# EAGLE design PT100RTD (EAGLE 6.5.0)
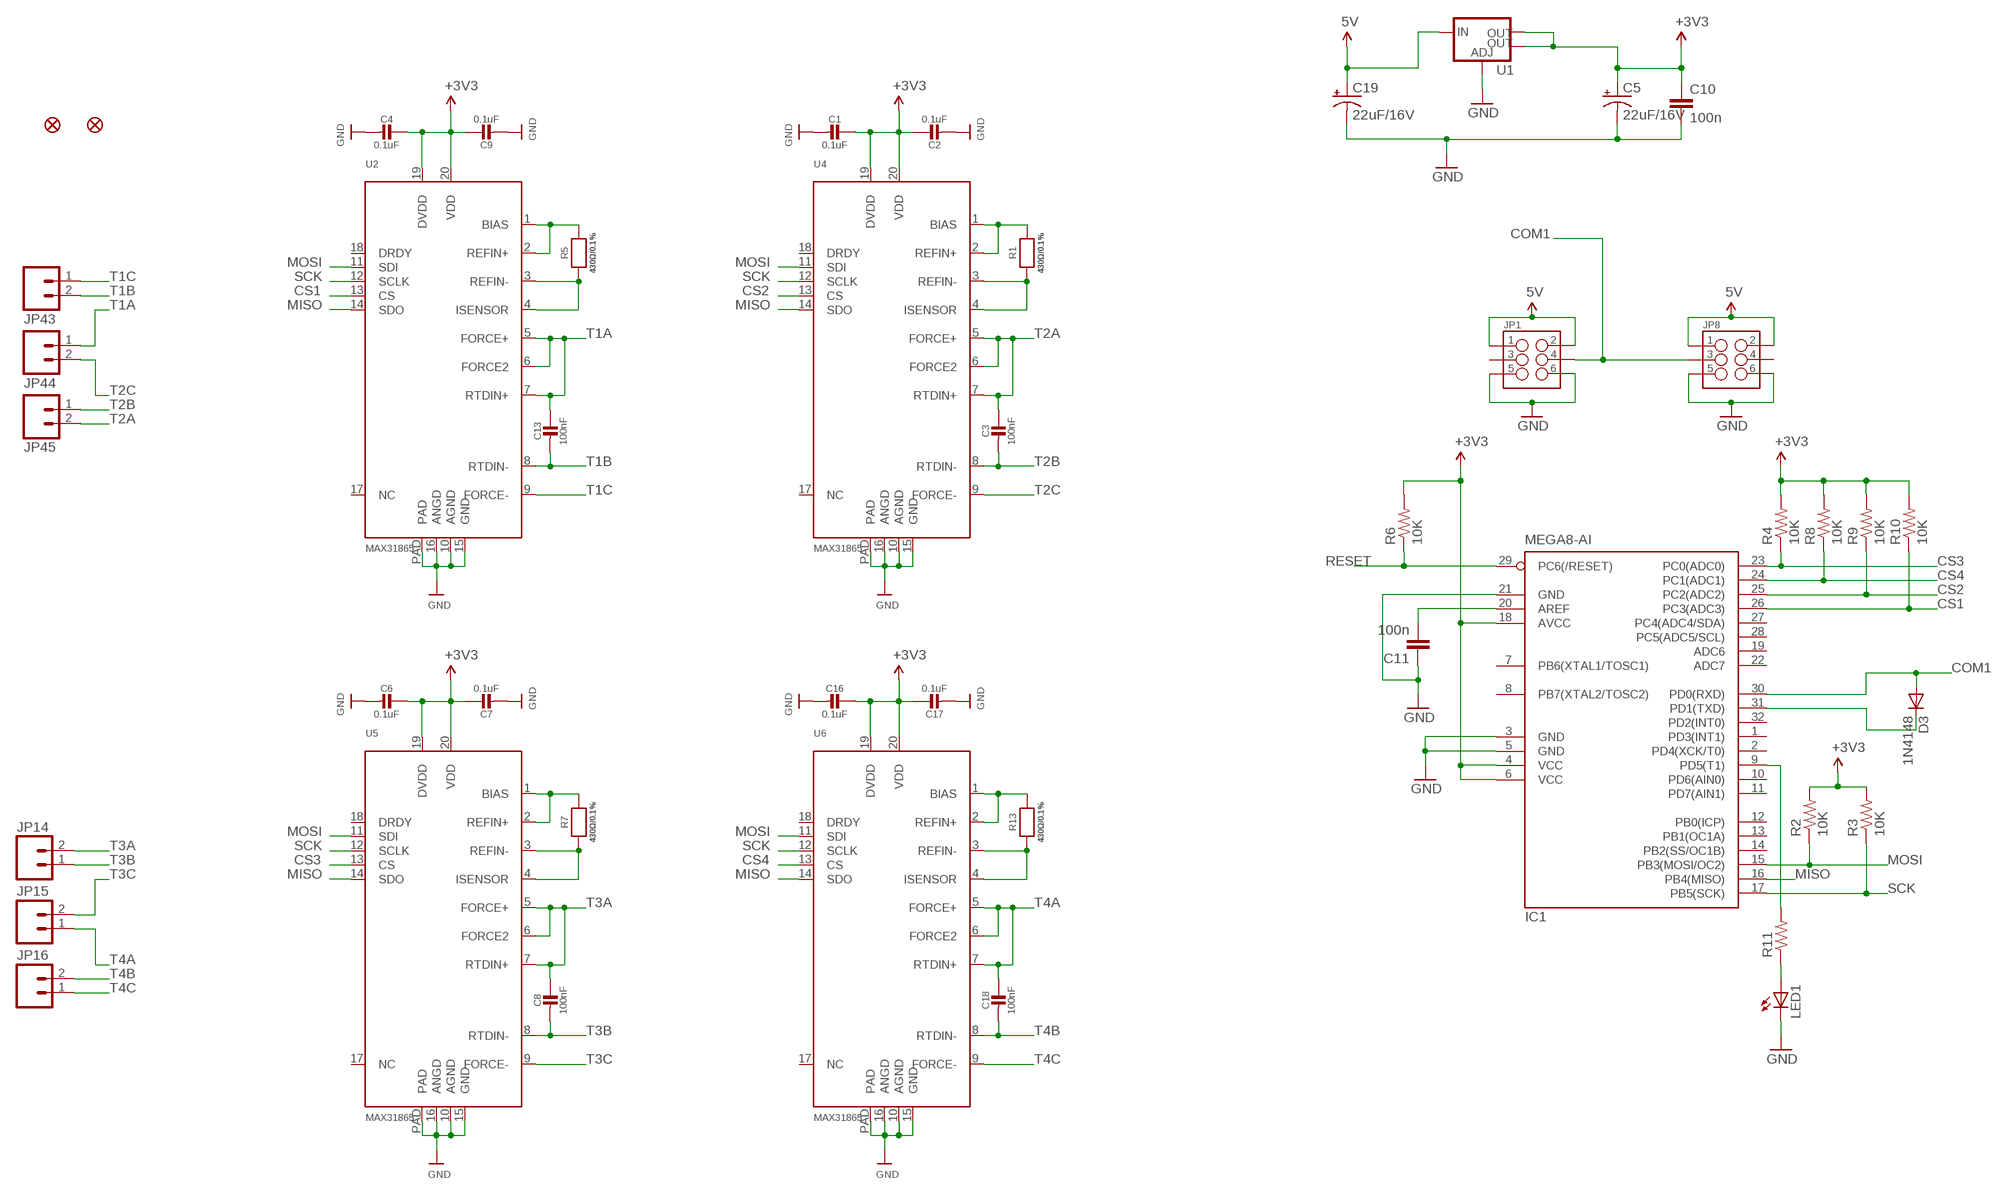
[diagram p0: schematic, sheet 1]

## Parts
C1  0.1uF  CAP_CERAMIC0805-NOOUTLINE  [0805-NO]
C2  0.1uF  CAP_CERAMIC0805-NOOUTLINE  [0805-NO]
C3  100nF  CAP_CERAMIC0805-NOOUTLINE  [0805-NO]
C4  0.1uF  CAP_CERAMIC0805-NOOUTLINE  [0805-NO]
C5  22uF/16V  CAP_POL1206  [EIA3216]
C6  0.1uF  CAP_CERAMIC0805-NOOUTLINE  [0805-NO]
C7  0.1uF  CAP_CERAMIC0805-NOOUTLINE  [0805-NO]
C8  100nF  CAP_CERAMIC0805-NOOUTLINE  [0805-NO]
C9  0.1uF  CAP_CERAMIC0805-NOOUTLINE  [0805-NO]
C10  100n  CAP0805  [0805]
C11  100n  CAP0805  [0805]
C13  100nF  CAP_CERAMIC0805-NOOUTLINE  [0805-NO]
C16  0.1uF  CAP_CERAMIC0805-NOOUTLINE  [0805-NO]
C17  0.1uF  CAP_CERAMIC0805-NOOUTLINE  [0805-NO]
C18  100nF  CAP_CERAMIC0805-NOOUTLINE  [0805-NO]
C19  22uF/16V  CAP_POL1206  [EIA3216]
D3  1N4148  DIODE-MINIMELF  [MINIMELF]
FD1  FIDUCIALUFIDUCIAL  [FIDUCIAL-MICRO]
FD2  FIDUCIALUFIDUCIAL  [FIDUCIAL-MICRO]
IC1  MEGA8-AI  [TQFP32-08]
JP1  M03X22X3_SILK_MALE_PTH  [2X3]
JP8  M03X22X3_SILK_MALE_PTH  [2X3]
JP14  M025MM  [SCREWTERMINAL-5MM-2]
JP15  M025MM  [SCREWTERMINAL-5MM-2]
JP16  M025MM  [SCREWTERMINAL-5MM-2]
JP43  M025MM  [SCREWTERMINAL-5MM-2]
JP44  M025MM  [SCREWTERMINAL-5MM-2]
JP45  M025MM  [SCREWTERMINAL-5MM-2]
LED1  LEDCHIP-LED0805  [CHIP-LED0805]
R1  430Ω/0.1%  RESISTOR0805_NOOUTLINE  [0805-NO]
R2  10K  RESISTOR0805-RES  [0805]
R3  10K  RESISTOR0805-RES  [0805]
R4  10K  RESISTOR0805-RES  [0805]
R5  430Ω/0.1%  RESISTOR0805_NOOUTLINE  [0805-NO]
R6  10K  RESISTOR0805-RES  [0805]
R7  430Ω/0.1%  RESISTOR0805_NOOUTLINE  [0805-NO]
R8  10K  RESISTOR0805-RES  [0805]
R9  10K  RESISTOR0805-RES  [0805]
R10  10K  RESISTOR0805-RES  [0805]
R11  RESISTOR0805-RES  [0805]
R13  430Ω/0.1%  RESISTOR0805_NOOUTLINE  [0805-NO]
U1  V_REG_LM1117SOT223  [SOT223]
U2  MAX31865  TEMP_MAX31865  [QFN20_4MM_0.65MM]
U4  MAX31865  TEMP_MAX31865  [QFN20_4MM_0.65MM]
U5  MAX31865  TEMP_MAX31865  [QFN20_4MM_0.65MM]
U6  MAX31865  TEMP_MAX31865  [QFN20_4MM_0.65MM]

## Nets
5V: C19.A(+) JP1.1 JP1.2 JP8.1 JP8.2 U1.3(IN)
COM1: D3.A IC1.30(PD0(RXD)) JP1.4 JP8.3
CS1: IC1.26(PC3(ADC3)) R10.1 U2.13(CS)
CS2: IC1.25(PC2(ADC2)) R9.1 U4.13(CS)
CS3: IC1.23(PC0(ADC0)) R4.1 U5.13(CS)
CS4: IC1.24(PC1(ADC1)) R8.1 U6.13(CS)
GND: C1.2 C2.2 C4.2 C5.C(-) C6.2 C7.2 C9.2 C10.2 C11.1 C16.2 C17.2 C19.C(-) IC1.3(GND) IC1.5(GND) IC1.21(GND) JP1.5 JP1.6 JP8.5 JP8.6 LED1.C U1.1(ADJ) U2.10(AGND) U2.15(GND) U2.16(ANGD) U2.PAD U4.10(AGND) U4.15(GND) U4.16(ANGD) U4.PAD U5.10(AGND) U5.15(GND) U5.16(ANGD) U5.PAD U6.10(AGND) U6.15(GND) U6.16(ANGD) U6.PAD
MISO: IC1.16(PB4(MISO)) U2.14(SDO) U4.14(SDO) U5.14(SDO) U6.14(SDO)
MOSI: IC1.15(PB3(MOSI/OC2)) R2.1 U2.11(SDI) U4.11(SDI) U5.11(SDI) U6.11(SDI)
N$1: LED1.A R11.1
N$2: D3.C IC1.31(PD1(TXD))
N$3: R5.2 U2.1(BIAS) U2.2(REFIN+)
N$4: R5.1 U2.3(REFIN-) U2.4(ISENSOR)
N$5: C11.2 IC1.20(AREF)
N$6: R1.2 U4.1(BIAS) U4.2(REFIN+)
N$7: R1.1 U4.3(REFIN-) U4.4(ISENSOR)
N$9: R7.2 U5.1(BIAS) U5.2(REFIN+)
N$10: R7.1 U5.3(REFIN-) U5.4(ISENSOR)
N$11: IC1.9(PD5(T1)) R11.2
N$13: R13.2 U6.1(BIAS) U6.2(REFIN+)
N$14: R13.1 U6.3(REFIN-) U6.4(ISENSOR)
RESET: IC1.29(PC6(/RESET)) R6.1
SCK: IC1.17(PB5(SCK)) R3.1 U2.12(SCLK) U4.12(SCLK) U5.12(SCLK) U6.12(SCLK)
T1A: C13.1 JP44.1 U2.5(FORCE+) U2.6(FORCE2) U2.7(RTDIN+)
T1B: C13.2 JP43.2 U2.8(RTDIN-)
T1C: JP43.1 U2.9(FORCE-)
T2A: C3.1 JP45.2 U4.5(FORCE+) U4.6(FORCE2) U4.7(RTDIN+)
T2B: C3.2 JP45.1 U4.8(RTDIN-)
T2C: JP44.2 U4.9(FORCE-)
T3A: C8.1 JP14.2 U5.5(FORCE+) U5.6(FORCE2) U5.7(RTDIN+)
T3B: C8.2 JP14.1 U5.8(RTDIN-)
T3C: JP15.2 U5.9(FORCE-)
T4A: C18.1 JP15.1 U6.5(FORCE+) U6.6(FORCE2) U6.7(RTDIN+)
T4B: C18.2 JP16.2 U6.8(RTDIN-)
T4C: JP16.1 U6.9(FORCE-)
VCC: C1.1 C2.1 C4.1 C5.A(+) C6.1 C7.1 C9.1 C10.1 C16.1 C17.1 IC1.4(VCC) IC1.6(VCC) IC1.18(AVCC) R2.2 R3.2 R4.2 R6.2 R8.2 R9.2 R10.2 U1.2(OUT) U1.4(OUT) U2.19(DVDD) U2.20(VDD) U4.19(DVDD) U4.20(VDD) U5.19(DVDD) U5.20(VDD) U6.19(DVDD) U6.20(VDD) ; supply symbol labelled +3V3
Unconnected: IC1.1(PD3(INT1)) IC1.2(PD4(XCK/T0)) IC1.7(PB6(XTAL1/TOSC1)) IC1.8(PB7(XTAL2/TOSC2)) IC1.10(PD6(AIN0)) IC1.11(PD7(AIN1)) IC1.12(PB0(ICP)) IC1.13(PB1(OC1A)) IC1.14(PB2(SS/OC1B)) IC1.19(ADC6) IC1.22(ADC7) IC1.27(PC4(ADC4/SDA)) IC1.28(PC5(ADC5/SCL)) IC1.32(PD2(INT0)) JP1.3 JP8.4 U2.17(NC) U2.18(DRDY) U4.17(NC) U4.18(DRDY) U5.17(NC) U5.18(DRDY) U6.17(NC) U6.18(DRDY)

## Library data of the parts
C1-C4 C6-C9 C13 C16-C18 = microbuilder:CAP_CERAMIC: Ceramic Capacitors For new designs, use the packages preceded by an '_' character since they are more reliable: The following footprints should be used on most boards: _0402 - Standard footprint for regular board layouts _0603 - Standard footprint for regular board layouts _0805 - Standard footprint for regular board layouts _1206 - Standard footprint for regular board layouts For extremely tight-pitch boards where space is at a premium, the following 'micro-pitch' footprints can be used (smaller pads, no silkscreen outline, etc.): _0402MP - Micro-pitch footprint for very dense/compact boards _0603MP - Micro-pitch footprint for very dense/compact boards _0805MP - Micro-pitch footprint for very dense/compact boards _1206MP - Micro-pitch footprint for very dense/compact boards
C5 C19 = SparkFun-Passives:CAP_POL: Capacitor Polarized These are standard SMD and PTH capacitors. Normally 10uF, 47uF, and 100uF in electrolytic and tantalum varieties. Always verify the external diameter of the through hole cap, it varies with capacity, voltage, and manufacturer. The EIA devices should be standard.
C10 C11 = SparkFun-Passives:CAP: Capacitor Standard 0603 ceramic capacitor, and 0.1" leaded capacitor.
D3 = diode:DIODE-: DIODE
FD1 FD2 = SparkFun-Aesthetics:FIDUCIAL: Fiducial Alignment Points Point-of-reference for pick-and-place machines and other optical instruments.
IC1 = atmel:MEGA8: MICROCONTROLLER 8 Kbytes FLASH, 1 kbytes SRAM, 512 bytes EEPROM, USART, 6-channel 10 bit ADC, 2-channel 8 bit ADC Pin compatible with Atmega48, ATMega88, ATMega168 Source: avr.lbr; MPN: ATMEGA8-16AU; OC_FARNELL: 9171371; OC_NEWARK: 73M8863
JP1 JP8 = SparkFun-Connectors:M03X2: 2x3 .1" header. Shrouded, with keying- CONN-10681 SMT- CONN-11415 Pogo pins- HW-11044; PROD_ID: CONN-09701
JP14-JP16 JP43-JP45 = SparkFun-Connectors:M02: Standard 2-pin 0.1" header. Use with - straight break away headers ( PRT-00116) - right angle break away headers (PRT-00553) - swiss pins (PRT-00743) - machine pins (PRT-00117) - female headers (PRT-00115) Molex polarized connector foot print use with: PRT-08233 with associated crimp pins and housings. 2.54_SCREWTERM for use with PRT-10571. 3.5mm Screw Terminal footprints for PRT-08084 5mm Screw Terminal footprints for use with PRT-08432; STOREFRONT_ID: PRT-08432
LED1 = led:LED: LED OSRAM: - CHIPLED LG R971, LG N971, LY N971, LG Q971, LY Q971, LO R971, LY R971 LH N974, LH R974 LS Q976, LO Q976, LY Q976 LO Q996 - Hyper CHIPLED LW Q18S LB Q993, LB Q99A, LB R99A - SideLED LS A670, LO A670, LY A670, LG A670, LP A670 LB A673, LV A673, LT A673, LW A673 LH A674 LY A675 LS A676, LA A676, LO A676, LY A676, LW A676 LS A679, LY A679, LG A679 - Hyper Micro SIDELED® LS Y876, LA Y876, LO Y876, LY Y876 LT Y87S - SmartLED LW L88C, LW L88S LB L89C, LB L89S, LG L890 LS L89K, LO L89K, LY L89K LS L896, LA L896, LO L896, LY L896 - TOPLED LS T670, LO T670, LY T670, LG T670, LP T670 LSG T670, LSP T670, LSY T670, LOP T670, LYG T670 LG T671, LOG T671, LSG T671 LB T673, LV T673, LT T673, LW T673 LH T674 LS T676, LA T676, LO T676, LY T676, LB T676, LH T676, LSB T676, LW T676 LB T67C, LV T67C, LT T67C, LS T67K, LO T67K, LY T67K, LW E67C LS E67B, LA E67B, LO E67B, LY E67B, LB E67C, LV E67C, LT E67C LW T67C LS T679, LY T679, LG T679 LS T770, LO T770, LY T770, LG T770, LP T770 LB T773, LV T773, LT T773, LW T773 LH T774 LS E675, LA E675, LY E675, LS T675 LS T776, LA T776, LO T776, LY T776, LB T776 LHGB T686 LT T68C, LB T68C - Hyper Mini TOPLED® LB M676 - Mini TOPLED Santana® LG M470 LS M47K, LO M47K, LY M47K Source: http://www.osram.convergy.de LUXEON: - LUMILED® LXK2-PW12-R00, LXK2-PW12-S00, LXK2-PW14-U00, LXK2-PW14-V00 LXK2-PM12-R00, LXK2-PM12-S00, LXK2-PM14-U00 LXK2-PE12-Q00, LXK2-PE12-R00, LXK2-PE12-S00, LXK2-PE14-T00, LXK2-PE14-U00 LXK2-PB12-K00, LXK2-PB12-L00, LXK2-PB12-M00, LXK2-PB14-N00, LXK2-PB14-P00, LXK2-PB14-Q00 LXK2-PR12-L00, LXK2-PR12-M00, LXK2-PR14-Q00, LXK2-PR14-R00 LXK2-PD12-Q00, LXK2-PD12-R00, LXK2-PD12-S00 LXK2-PH12-R00, LXK2-PH12-S00 LXK2-PL12-P00, LXK2-PL12-Q00, LXK2-PL12-R00 Source: www.luxeon.com KINGBRIGHT: KA-3528ASYC Source: www.kingbright.com
R1 R5 R7 R13 = microbuilder:RESISTOR: Resistors For new designs, use the packages preceded by an '_' character since they are more reliable: The following footprints should be used on most boards: _0402 - Standard footprint for regular board layouts _0603 - Standard footprint for regular board layouts _0805 - Standard footprint for regular board layouts _1206 - Standard footprint for regular board layouts For extremely tight-pitch boards where space is at a premium, the following 'micro-pitch' footprints can be used (smaller pads, no silkscreen outline, etc.): _0402MP - Micro-pitch footprint for very dense/compact boards _0603MP - Micro-pitch footprint for very dense/compact boards _0805MP - Micro-pitch footprint for very dense/compact boards _1206MP - Micro-pitch footprint for very dense/compact boards
R2-R4 R6 R8-R11 = SparkFun-Passives:RESISTOR: Resistor Basic schematic elements and footprints for 0603, 1206, and PTH resistors.
U1 = SparkFun-PowerIC:V_REG_LM1117: Voltage Regulator LM1117 Standard adjustable voltage regulator but in SMD form. Spark Fun Electronics SKU : COM-00595; PROD_ID: VREG-08170
U2 U4-U6 = microbuilder:TEMP_MAX31865: MAX31865 - Resistance to Digital Convertor for Platinum Resistance Temperature Detectors (RTDs) Handles 100 ohm - 1K ohm (at 0°C) platinum RTDs. 15-bit ADC resolution (nominally 0.03125°C), 0.5°C accuracy.

## Board
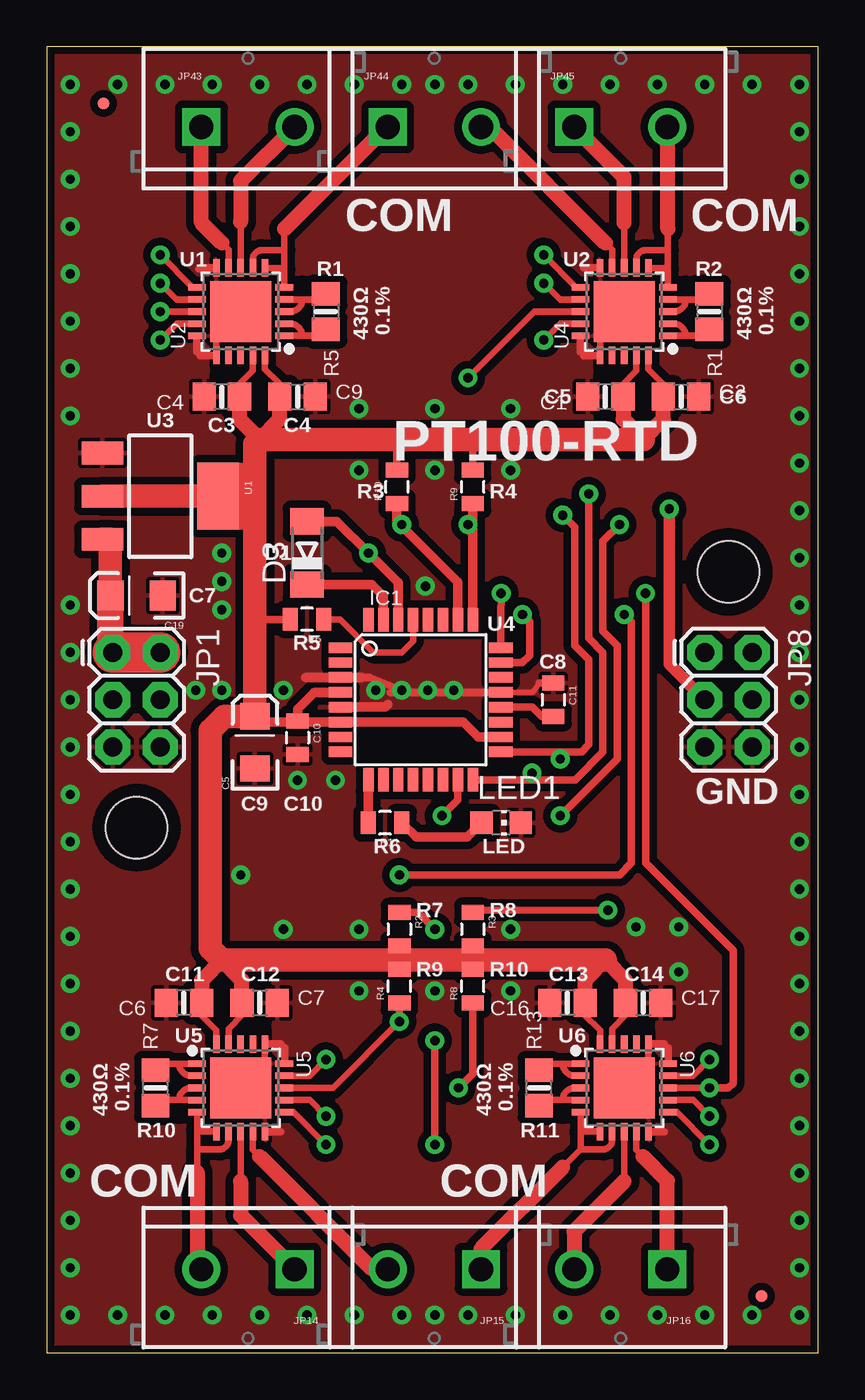
[diagram p1: board, top side]
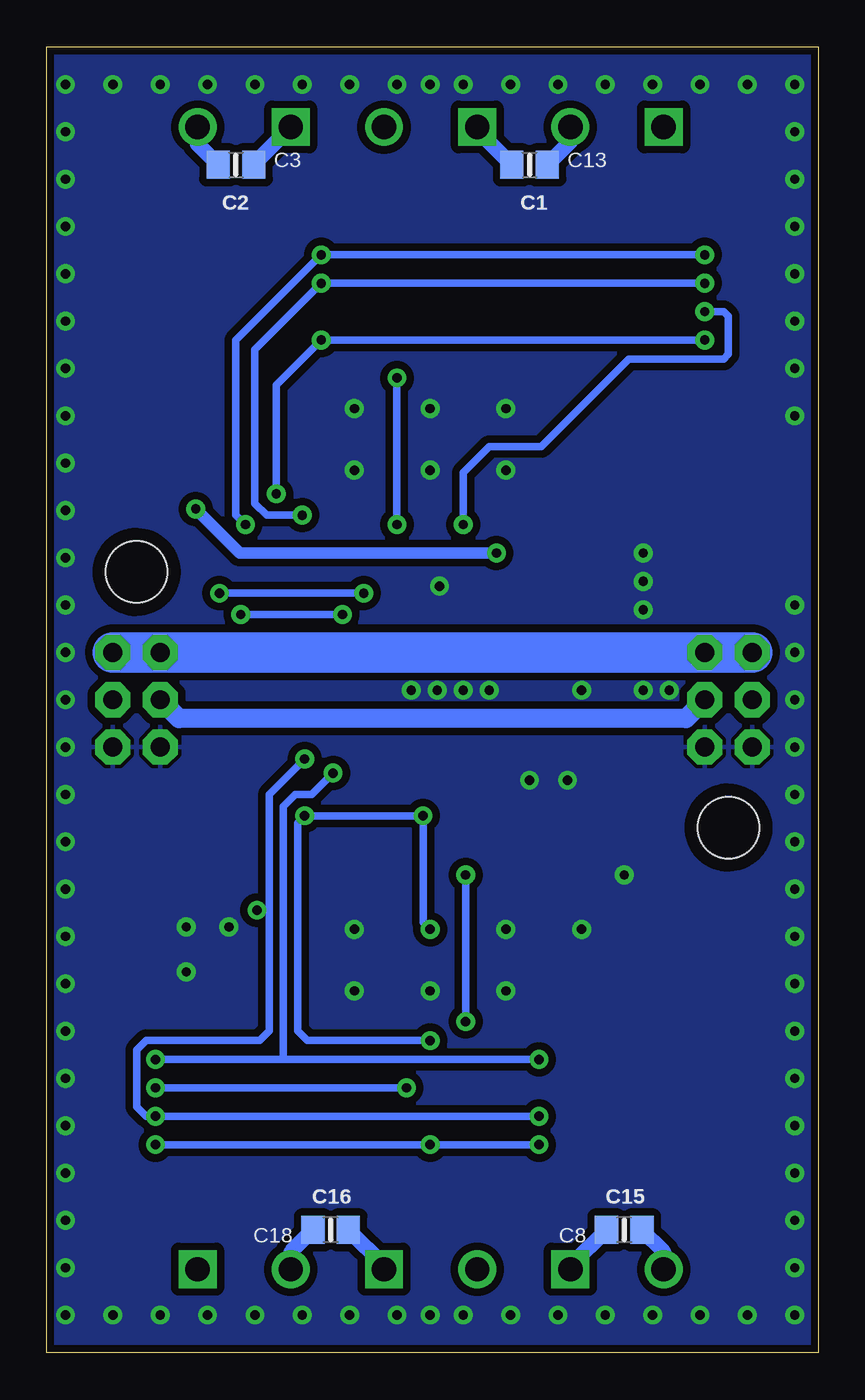
[diagram p2: board, bottom side, seen from below]

Size 41.4 x 70.1 mm. Coordinates in mm from the lower left corner, seen from the top.
Outline: 0,0 41.4,0 41.4,70.1 0,70.1 0,0
Copper layers (1*16): Top 0.035mm / dielectric 1.5mm / Bottom 0.035mm
Design rules "default *": minimum track width 8mil, minimum drill 0.4mm, track to track 8mil, track to pad 8mil, pad to pad 8mil, via to via 8mil, smd to smd 8mil, copper to edge 10mil, drill to drill 8mil, minimum pad ring 8mil, minimum via ring 10mil, stop-mask expansion 3mil, vias tented up to drill 0mil, thermal gap 8mil
tRestrict: area 11.4,17.3 to 11.7,17.8; area 32,17.3 to 32.3,17.8; area 9.1,52.5 to 9.4,53; area 29.7,52.5 to 30,53; area 27.7,54.6 to 27.9,54.9; area 7.1,54.6 to 7.4,54.9; area 13.5,15.2 to 13.7,15.5; area 34,15.2 to 34.3,15.5; area 11.4,19.7 to 11.7,20.2; area 27.7,19.7 to 27.9,20.2; area 13.5,50 to 13.7,50.5; area 29.7,49.9 to 30,50.4; 4 more areas

### Footprints (pad centres in the part's own frame; a part is rotated, then mirrored left to right if it is on the bottom)
0805-NO = smd 1.24 x 1.5: 1 -0.95,0; 2 0.95,0
EIA3216 = smd 1.4 x 1.6: A 1.4,0; C -1.4,0
0805 = smd 0.8 x 1.2: 1 -0.9,0; 2 0.9,0
MINIMELF = smd 1.4 x 1.8: A 1.7,0; C -1.7,0
FIDUCIAL-MICRO = smd 0.635 x 0.635: 1 0,0
TQFP32-08 = smd 1.27 x 0.559: 1 -4.293,2.8; 2 -4.293,2; 3 -4.293,1.2; 4 -4.293,0.4; 5 -4.293,-0.4; 6 -4.293,-1.2; 7 -4.293,-2; 8 -4.293,-2.8; 17 4.293,-2.8; 18 4.293,-2; 19 4.293,-1.2; 20 4.293,-0.4; 21 4.293,0.4; 22 4.293,1.2; 23 4.293,2; 24 4.293,2.8 | smd 0.559 x 1.27: 9 -2.8,-4.293; 10 -2,-4.293; 11 -1.2,-4.293; 12 -0.4,-4.293; 13 0.4,-4.293; 14 1.2,-4.293; 15 2,-4.293; 16 2.8,-4.293; 25 2.8,4.293; 26 2,4.293; 27 1.2,4.293; 28 0.4,4.293; 29 -0.4,4.293; 30 -1.2,4.293; 31 -2,4.293; 32 -2.8,4.293
2X3 = drill 1.016 pad 1.88 octagon: 1 0,0; 2 0,2.54; 3 2.54,0; 4 2.54,2.54; 5 5.08,0; 6 5.08,2.54
SCREWTERMINAL-5MM-2 = drill 1.3 pad 2.032 square: 1 0,0 | drill 1.3 pad 2.032: 2 5,0
CHIP-LED0805 = smd 1.2 x 1.2: A 0,-1.05; C 0,1.05
STAND-OFF = hole 3.302: 0,0
SOT223 = smd 1.219 x 2.235: 1 -2.311,-3.099; 2 0,-3.099; 3 2.311,-3.099 | smd 3.6 x 2.2: 4 0,3.099
QFN20_4MM_0.65MM = smd 0.35 x 0.95: 1 -1.3,-2.34; 2 -0.65,-2.34; 3 0,-2.34; 4 0.65,-2.34; 5 1.3,-2.34; 11 1.3,2.34; 12 0.65,2.34; 13 0,2.34; 14 -0.65,2.34; 15 -1.3,2.34 | smd 0.95 x 0.35: 6 2.34,-1.3; 7 2.34,-0.65; 8 2.34,0; 9 2.34,0.65; 10 2.34,1.3; 16 -2.34,1.3; 17 -2.34,0.65; 18 -2.34,0; 19 -2.34,-0.65; 20 -2.34,-1.3 | smd 3.25 x 3.25: PAD 0,0

### Placement (x,y rotation side)
C1  29.97,51.31 180 top
C2  34.04,51.31 0 top
C3  31.24,63.75 0 bottom
C4  9.4,51.31 180 top
C5  11.18,32.77 90 top
C6  7.37,18.8 180 top
C7  11.43,18.8 0 top
C8  10.41,6.6 180 bottom
C9  13.46,51.31 0 top
C10  13.46,33.02 270 top
C11  27.18,35.05 270 top
C13  15.49,63.75 0 bottom
C16  27.94,18.8 180 top
C17  32,18.8 0 top
C18  26.16,6.6 180 bottom
C19  4.83,40.64 180 top
D3  13.97,42.93 90 top
FD1  38.35,3.05 0 top
FD2  3.05,67.06 0 top
IC1  20.07,35.05 0 top
JP1  3.56,37.59 270 top
JP8  35.31,37.59 270 top
JP14  13.3,4.49 180 top
JP15  23.3,4.49 180 top
JP16  33.3,4.49 180 top
JP43  8.3,65.79 0 top
JP44  18.3,65.79 0 top
JP45  28.3,65.79 0 top
LED1  24.38,28.45 270 top
R1  35.56,55.88 270 top
R2  18.92,22.73 270 top
R3  22.86,22.73 270 top
R4  18.92,19.68 90 top
R5  14.99,55.88 270 top
R6  13.97,39.37 180 top
R7  5.84,14.22 90 top
R8  22.86,19.68 90 top
R9  22.86,46.48 90 top
R10  18.8,46.48 90 top
R11  18.16,28.45 180 top
R13  26.42,14.22 90 top
STANDOFF2  STAND-OFF  [STAND-OFF]  36.58,41.91 180 top
STANDOFF3  STAND-OFF  [STAND-OFF]  4.83,28.19 180 top
U1  6.1,45.97 270 top
U2  10.41,55.88 90 top
U4  30.99,55.88 90 top
U5  10.41,14.22 270 top
U6  30.99,14.22 270 top

### Tracks (layer width: path | path; a pad name or v marks a point on that pad's centre or on a via)
5V
  Top 1.27: 5.33,37.59 4.57,37.59 | U1.3 3.43,43.66 C19.A
  Top 1.422: JP1.1 3.43,37.59 C19.A
  Top 2.184: JP1.1 4.57,37.59 JP1.2
  Bottom 2.184: JP1.1 JP1.2 JP8.1 JP8.2
COM1  (via drill 0.5)
  Top 0.508: IC1.30 18.87,41.33 v17.27,42.93 15.57,44.63 D3.A
  Top 0.61: JP8.3 33.4,36.96 v33.4,45.29
  Bottom 0.61: v17.27,42.93 31.04,42.93 v33.4,45.29
  Bottom 1.016: JP1.4 7.11,34.04 34.29,34.04 JP8.3
CS1  (via drill 0.5)
  Top 0.356: U2.13 v6.1,55.88
  Top 0.406: 19.05,44.39 v19.05,44.45
  Top 0.508: IC1.26 22.07,41.37 19.05,44.39 | R10.1 18.8,44.7 v19.05,44.45
  Bottom 0.406: v6.1,55.88 5.08,55.88 4.83,55.63 4.83,53.59 5.08,53.34 10.16,53.34 14.86,48.64 17.65,48.64 19.05,47.24 v19.05,44.45
CS2  (via drill 0.5)
  Top 0.356: U4.13 26.16,55.88 v22.61,52.32
  Top 0.406: IC1.25
  Top 0.508: IC1.25 22.86,44.2 v22.61,44.45 22.86,44.7 R9.1
  Bottom 0.406: v22.61,52.32 v22.61,44.45
CS3  (via drill 0.5)
  Top 0.356: U5.13 15.37,14.22 v18.92,17.78
  Top 0.406: IC1.23 25.53,37.05 25.91,37.43 25.91,39.24 v25.53,39.62 | v30.99,39.62 31.37,39.24 31.37,26.29 30.73,25.65 v18.92,25.65 | R4.1 v18.92,17.78
  Bottom 0.406: v25.53,39.62 v30.99,39.62 | v18.92,17.78 v18.92,25.65
CS4  (via drill 0.5)
  Top 0.356: U6.13 v35.56,14.22
  Top 0.406: IC1.24 24.36,39.47 v24.38,40.77 | v32.13,40.77 32.13,26.29 36.83,21.59 36.83,14.48 36.58,14.22 v35.56,14.22 | R8.1 22.86,14.99 v22.1,14.22
  Bottom 0.406: v24.38,40.77 v32.13,40.77 | v22.1,14.22 v35.56,14.22
GND  (via drill 0.5)
  Top 0.305: 26.42,35.95 26.16,35.56 26.05,35.45 IC1.21
  Top 0.356: U2.10 9.06,58.17 8.13,58.17 | U2.PAD 9.11,55.88 U2.16 | U4.PAD 29.69,55.88 U4.16 | U5.PAD 11.71,14.22 U5.16 | U6.PAD 32.29,14.22 U6.16
  Top 0.406: C11.1 26.42,35.95 | IC1.3 17.34,36.25 v19.05,35.56 18.43,35.45 IC1.21 | 8.26,53.53 9.02,53.53 | 8.06,53.72 8.06,54.48 | 28.64,53.72 28.64,54.48 | 29.59,53.53 28.83,53.53 | 29.59,58.23 28.83,58.23 | 9.02,58.23 8.26,58.23 | 32.38,11.87 33.15,11.87 | 32.38,16.57 33.15,16.57 | 33.34,15.62 33.34,16.38 | 12.57,16.57 11.81,16.57 | 12.76,16.38 12.76,15.62 | 11.81,11.87 12.57,11.87
  Top 0.508: IC1.5 18.18,34.65 18.29,34.8 | 13.89,36.25 16.91,36.25
  other vias: 21.84,35.56 15.49,30.73 20.45,35.56 12.7,35.56 13.46,30.73 9.4,35.56 1.27,37.59 1.27,35.05 1.27,32.51 40.39,37.59 40.39,35.05 40.39,32.51 8,35.56 17.65,35.56 20.32,41.15 24.89,50.67 16.76,50.67 20.83,50.67 20.83,47.37 24.89,47.37 16.76,47.37 16.76,22.73 16.76,19.43 33.91,20.45 20.83,19.43 24.89,19.43 24.89,22.73 9.4,41.4 9.4,42.93 1.27,40.13 9.4,39.88 40.39,40.13 40.39,42.67 1.27,29.97 1.27,27.43 40.39,29.97 40.39,27.43 40.39,45.21 40.39,47.75 40.39,50.29 40.39,52.83 40.39,55.37 40.39,57.91 40.39,60.45 40.39,62.99 40.39,65.53 40.39,68.07 1.27,50.29 1.27,52.83 1.27,55.37 1.27,57.91 1.27,60.45 1.27,62.99 1.27,65.53 1.27,68.07 1.27,24.89 1.27,22.35 1.27,19.81 1.27,17.27 1.27,14.73 1.27,12.19 1.27,9.65 1.27,7.11 1.27,4.57 1.27,2.03 40.39,24.89 40.39,22.35 40.39,19.81 40.39,17.27 40.39,14.73 40.39,12.19 40.39,9.65 40.39,7.11 40.39,4.57 40.39,2.03 3.81,2.03 6.35,2.03 8.89,2.03 11.43,2.03 13.97,2.03 16.51,2.03 19.05,2.03 37.85,2.03 35.31,2.03 32.77,2.03 30.23,2.03 27.69,2.03 25.15,2.03 22.61,2.03 20.83,2.03 3.81,68.07 6.35,68.07 8.89,68.07 11.43,68.07 13.97,68.07 16.51,68.07 19.05,68.07 37.85,68.07 35.31,68.07 32.77,68.07 30.23,68.07 27.69,68.07 25.15,68.07 22.61,68.07 20.83,68.07 12.7,22.73 10.41,25.65 31.62,22.86 33.91,22.86
  pour Bottom (isolate 0.406): 0,70.1 41.4,70.1 41.4,0 0,0
  pour Top (isolate 0.406): 0,70.1 41.4,70.1 41.4,0 0,0
MISO  (via drill 0.5)
  Top 0.356: U2.14 6.97,55.23 v6.1,54.36 | U4.14 27.54,55.23 v26.67,54.36 | U6.14 34.69,14.87 v35.56,15.75 | U5.14 14.11,14.87 v14.99,15.75 | 28.35,30.76 26.04,30.76 v26.04,31.11
  Top 0.406: v29.08,46.1 29.08,38.35 29.84,37.59 29.84,32.26 28.35,30.76 IC1.16
  Bottom 0.406: v6.1,54.36 v26.67,54.36 29.08,51.94 v29.08,46.1 | v14.99,15.75 28.7,15.75 | v35.56,15.75 29.34,15.75 28.7,15.75 | v26.04,31.11 27.18,29.97 28.07,29.97 28.7,29.34 28.7,15.75
MOSI  (via drill 0.5)
  Top 0.356: U2.11 7.84,57.18 v6.1,58.93 | v26.67,58.93 28.42,57.18 U4.11 | U6.11 33.81,12.92 v35.56,11.18 | U5.11 13.24,12.92 v14.99,11.18
  Top 0.406: IC1.15 22.07,29.69 v21.21,28.83 | v30.73,44.45 29.84,43.56 29.84,38.73 30.61,37.97 30.61,31.88 v27.56,28.83 | v20.83,16.76 v20.83,11.18 | 19.05,23.63 R2.1 19.93,23.63 v20.83,22.73
  Bottom 0.406: v6.1,58.93 v26.67,58.93 31.24,54.36 31.24,44.96 v30.73,44.45 | v35.56,11.18 v20.83,11.18 v14.99,11.18 | v20.83,16.76 27.43,16.76 27.94,17.27 27.94,28.45 v27.56,28.83 v21.21,28.83 21.21,23.11 v20.83,22.73
N$1
  Top 0.508: LED1.A 22.57,27.69 19.82,27.69 R11.1
N$2
  Top 0.508: IC1.31 18.07,40.61 17.45,41.23 D3.C
N$3
  Top 0.305: 14.99,54.58 R5.2
  Top 0.356: U2.1 13.72,54.58 | 13.72,54.58 14.99,54.58 | U2.2 13.07,55.23 arc-90 13.72,54.58
N$4
  Top 0.305: 14.69,56.53 arc90 R5.1
  Top 0.356: U2.4 13.72,56.53 | 13.72,56.53 14.69,56.53 | U2.3 13.07,55.88 arc90 13.72,56.53
N$5
  Top 0.406: IC1.20 26.05,34.65 26.55,34.15 C11.2
N$6
  Top 0.305: 35.21,54.58 arc90 R1.2
  Top 0.356: U4.1 34.29,54.58 | 34.29,54.58 35.21,54.58 | U4.2 33.64,55.23 arc-90 34.29,54.58
N$7
  Top 0.305: 35.26,56.53 arc90 R1.1
  Top 0.356: U4.4 34.29,56.53 | 34.29,56.53 35.26,56.53 | U4.3 33.64,55.88 arc90 34.29,56.53
N$9
  Top 0.305: 6.19,15.52 arc90 R7.2
  Top 0.356: U5.1 7.11,15.52 | 7.11,15.52 6.19,15.52 | U5.2 7.76,14.87 arc-90 7.11,15.52
N$10
  Top 0.305: 6.14,13.57 arc90 R7.1
  Top 0.356: U5.4 7.11,13.57 | 7.11,13.57 6.14,13.57 | U5.3 7.76,14.22 arc90 7.11,13.57
N$11
  Top 0.508: IC1.9 R11.2
N$13
  Top 0.305: 26.77,15.52 arc90 R13.2
  Top 0.356: U6.1 27.69,15.52 | 27.69,15.52 26.77,15.52 | U6.2 28.34,14.87 arc-90 27.69,15.52
N$14
  Top 0.305: 26.72,13.57 arc90 R13.1
  Top 0.356: U6.4 27.69,13.57 | 27.69,13.57 26.72,13.57 | U6.3 28.34,14.22 arc90 27.69,13.57
RESET
  Top 0.356: R6.1 15.75,39.37 17.53,37.59 19.05,37.59 19.67,38.21 IC1.29
SCK  (via drill 0.5)
  Top 0.356: U2.12 6.97,56.53 v6.1,57.4 | U4.12 27.54,56.53 v26.67,57.4 | U6.12 34.69,13.57 v35.56,12.7 | U5.12 14.11,13.57 v14.99,12.7
  Top 0.406: IC1.17 27.56,32.25 | v27.69,44.96 28.32,44.32 28.32,37.97 29.08,37.21 29.08,32.64 28.7,32.25 27.56,32.25 | 27.56,32.25 v27.56,31.88 | R3.1 22.86,23.75 v30.11,23.76
  Bottom 0.406: v6.1,57.4 v26.67,57.4 30.23,53.85 30.23,45.59 29.59,44.96 v27.69,44.96 | v14.99,12.7 v35.56,12.7 36.07,12.7 36.58,13.21 36.58,16.26 36.07,16.76 29.97,16.76 29.46,17.27 29.46,23.88 | v27.56,31.88 29.46,29.97 29.46,23.88 | v30.11,23.76 29.58,23.76 29.46,23.88
T1A
  Top 0.305: 12.7,58.22 arc-90 12.75,58.17
  Top 0.356: U2.5 12.75,58.17 12.75,59.18 | 12.75,59.18 12.75,60.32 | U2.6 12.7,58.22 | U2.7 11.06,58.69 arc-90 11.56,59.18 12.75,59.18
  Top 0.813: 12.75,60.32 18.23,65.79 JP44.1
  Bottom 0.813: C13.1 18.3,65.61 JP44.1
T1B
  Top 0.356: U2.8 10.41,60.71
  Top 0.813: JP43.2 10.41,62.9 10.41,60.71
  Bottom 0.813: JP43.2 13.3,65 C13.2
T1C
  Top 0.356: 9.4,59.56 9.76,59.2 U2.9
  Top 0.813: 9.4,59.56 8.3,60.66 JP43.1
T2A
  Top 0.305: 33.27,58.22 arc-90 33.33,58.17
  Top 0.356: U4.5 33.33,58.17 33.33,59.18 | 33.33,59.18 33.33,60.32 | U4.6 33.27,58.22 | U4.7 31.64,58.69 arc-90 32.13,59.18 33.33,59.18
  Top 0.813: 33.33,60.32 33.33,65.76 JP45.2
  Bottom 0.813: C3.1 33.3,64.86 JP45.2
T2B
  Top 0.356: U4.8 30.99,60.64
  Top 0.813: 30.99,60.64 30.99,63.1 JP45.1
  Bottom 0.813: JP45.1 30.29,63.8 C3.2
T2C
  Top 0.356: U4.9 30.34,59.2 29.97,59.56
  Top 0.813: 29.97,59.56 23.87,65.66 JP44.2
T3A
  Top 0.305: 8.13,11.88 arc-90 8.07,11.94
  Top 0.356: U5.5 8.07,11.94 8.07,10.92 | U5.6 8.13,11.88 | U5.7 9.76,11.41 arc-90 9.27,10.92 8.07,10.92 | 8.07,9.71 8.07,10.92
  Top 0.813: 8.07,9.71 8.07,4.72 JP14.2
  Bottom 0.813: C8.1 8.3,5.44 JP14.2
T3B
  Top 0.356: U5.8 10.41,9.21
  Top 0.813: 10.41,9.21 10.41,7.38 JP14.1
  Bottom 0.813: C8.2 13.3,4.67 JP14.1
T3C
  Top 0.356: U5.9 11.06,10.91 11.43,10.54
  Top 0.813: 11.43,10.54 17.48,4.49 JP15.2
T4A
  Top 0.356: U6.5 28.65,11.81 | 28.65,11.81 28.65,10.92 | U6.6 28.72,11.88 arc90 28.65,11.81 | U6.7 30.34,11.41 arc-90 29.84,10.92 28.65,10.92 | 27.69,9.96 28.65,10.92
  Top 0.813: 27.69,9.96 23.3,5.58 JP15.1
  Bottom 0.813: C18.1 23.3,4.69 JP15.1
T4B
  Top 0.356: U6.8 30.99,9.21
  Top 0.813: 30.99,9.21 28.3,6.52 JP16.2
  Bottom 0.813: C18.2 28.3,5.41 JP16.2
T4C
  Top 0.356: U6.9 31.64,10.91 32,10.54
  Top 0.813: JP16.1 33.3,9.24 32,10.54
VCC
  Top 0.356: U5.19 9.76,17.38 10.48,18.1 C7.1 | U6.19 30.34,17.38 31.05,18.1 C17.1 | U2.19 11.06,52.72 10.35,52 C4.1 | U4.19 31.64,52.72 30.92,52 C1.1 | 11.81,49.28 11.18,49.28 | U2.20 11.71,52.8 12.45,52.07 12.45,51.37 C9.1 | U4.20 32.29,52.8 33.15,51.94 33.15,51.37 C2.1 | U5.20 9.11,17.3 8.26,18.16 8.26,18.73 C6.1 | U6.20 29.69,17.3 28.83,18.16 28.83,18.73 C16.1
  Top 0.406: R6.2 11.43,39.37 11.18,39.62 | R3.2 22.86,21.08 R8.2 | R10.2 18.8,49.02 | R9.2 22.86,49.02 | R4.2 18.92,21.08 R2.2
  Top 0.508: IC1.18 23.15,33.05 22.35,33.85 IC1.6 13.46,33.85 | 13.46,33.85 C10.1 13.46,34.54 14.37,35.45 IC1.4 | 13.46,33.85 11.62,33.85 C5.A
  Top 0.813: C7.1 10.48,20 9.4,21.08 8.32,20 C6.1 | C16.1 28.89,20 29.97,21.08 31.05,20 C17.1 | C4.1 10.35,50.1 11.18,49.28 11.43,49.02 12.51,50.1 C9.1 | C1.1 30.92,50.1 32,49.02 33.09,50.1 C2.1
  Top 1.27: 32,49.02 22.86,49.02 18.8,49.02 11.43,49.02 11.18,48.77 11.18,45.72 | 29.97,21.08 22.86,21.08 18.92,21.08 9.4,21.08 8.77,21.71 8.77,33.4 9.53,34.17 C5.A 11.18,39.62 11.18,45.72 | U1.2 U1.4 10.92,45.97 11.18,45.72
(copper drawn outside any net)
  shapes: Top area x2

### Text on the board
tPlace: COM | COM | U1 | R1 | U2 | R2 | 0.1% | 0.1% | 430Ω | 430Ω | C5 | C6 | U3 | C3 | C4 | PT100-RTD | R3 | R4 | D1 | C7 | U4 | R5 | C8 | C9 | C10 | GND | R6 | LED | R7 | R8 | C11 | C12 | R9 | R10 | C13 | C14 | U5 | U6 | 0.1% | 430Ω | 0.1% | 430Ω | R10 | R11 | COM | COM
bPlace: C1 | C2 | C15 | C16